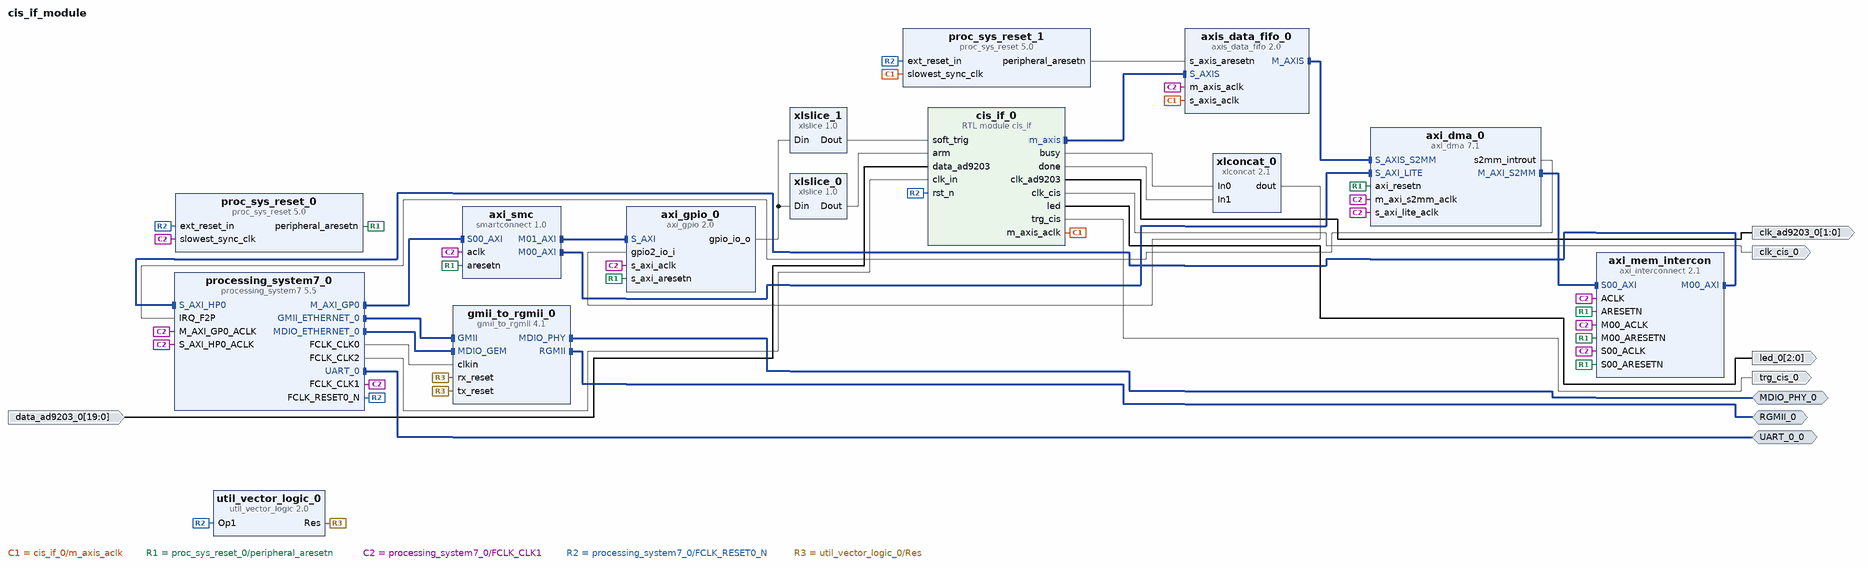
[diagram p0: block diagram of the top level]
# Vivado block design cis_if_module, xc7z020clg484-2, Vivado 2026.1
create_bd_design cis_if_module

create_bd_intf_port -mode Master -vlnv xilinx.com:interface:mdio_rtl:1.0 MDIO_PHY_0
create_bd_intf_port -mode Master -vlnv xilinx.com:interface:rgmii_rtl:1.0 RGMII_0
create_bd_intf_port -mode Master -vlnv xilinx.com:interface:uart_rtl:1.0 UART_0_0
create_bd_port -dir O clk_cis_0
create_bd_port -dir O -from 1 -to 0 clk_ad9203_0
create_bd_port -dir O trg_cis_0
create_bd_port -dir O -from 2 -to 0 led_0
create_bd_port -dir I -from 19 -to 0 data_ad9203_0

create_bd_cell -type ip -vlnv xilinx.com:ip:processing_system7:5.5 processing_system7_0
set_property -dict [list \
  CONFIG.PCW_ENET0_ENET0_IO EMIO \
  CONFIG.PCW_ENET0_GRP_MDIO_ENABLE 1 \
  CONFIG.PCW_ENET0_GRP_MDIO_IO EMIO \
  CONFIG.PCW_ENET0_PERIPHERAL_ENABLE 1 \
  CONFIG.PCW_EN_CLK1_PORT 1 \
  CONFIG.PCW_EN_CLK2_PORT 1 \
  CONFIG.PCW_FCLK_CLK1_BUF TRUE \
  CONFIG.PCW_FCLK_CLK2_BUF TRUE \
  CONFIG.PCW_FPGA0_PERIPHERAL_FREQMHZ 200 \
  CONFIG.PCW_FPGA1_PERIPHERAL_FREQMHZ 100 \
  CONFIG.PCW_FPGA_FCLK1_ENABLE 1 \
  CONFIG.PCW_FPGA_FCLK2_ENABLE 1 \
  CONFIG.PCW_IRQ_F2P_INTR 1 \
  CONFIG.PCW_QSPI_GRP_SINGLE_SS_ENABLE 1 \
  CONFIG.PCW_QSPI_GRP_SINGLE_SS_IO {MIO 1 .. 6} \
  CONFIG.PCW_QSPI_PERIPHERAL_ENABLE 1 \
  CONFIG.PCW_QSPI_QSPI_IO {MIO 1 .. 6} \
  CONFIG.PCW_SINGLE_QSPI_DATA_MODE x4 \
  CONFIG.PCW_UART0_PERIPHERAL_ENABLE 1 \
  CONFIG.PCW_UART0_UART0_IO EMIO \
  CONFIG.PCW_UART_PERIPHERAL_FREQMHZ 100 \
  CONFIG.PCW_UIPARAM_DDR_BUS_WIDTH {16 Bit} \
  CONFIG.PCW_UIPARAM_DDR_PARTNO {MT41J256M16 RE-125} \
  CONFIG.PCW_USE_FABRIC_INTERRUPT 1 \
  CONFIG.PCW_USE_S_AXI_HP0 1 \
] [get_bd_cells processing_system7_0]
# 58 more settings of processing_system7_0 are not shown: defaults, MIO pin electricals, DDR timing, and values the tool derives
create_bd_cell -type module -reference cis_if cis_if_0
create_bd_cell -type ip -vlnv xilinx.com:ip:axis_data_fifo:2.0 axis_data_fifo_0
set_property -dict [list \
  CONFIG.FIFO_DEPTH 1024 \
  CONFIG.HAS_TLAST 1 \
  CONFIG.IS_ACLK_ASYNC 1 \
  CONFIG.TDATA_NUM_BYTES 4 \
] [get_bd_cells axis_data_fifo_0]
create_bd_cell -type ip -vlnv xilinx.com:ip:axi_dma:7.1 axi_dma_0
set_property -dict [list \
  CONFIG.c_include_mm2s 0 \
  CONFIG.c_include_sg 0 \
  CONFIG.c_m_axi_s2mm_data_width 64 \
  CONFIG.c_s_axis_s2mm_tdata_width 32 \
  CONFIG.c_sg_length_width 23 \
] [get_bd_cells axi_dma_0]
create_bd_cell -type ip -vlnv xilinx.com:ip:axi_gpio:2.0 axi_gpio_0
set_property -dict [list \
  CONFIG.C_ALL_INPUTS_2 1 \
  CONFIG.C_ALL_OUTPUTS 1 \
  CONFIG.C_GPIO2_WIDTH 2 \
  CONFIG.C_GPIO_WIDTH 2 \
  CONFIG.C_IS_DUAL 1 \
] [get_bd_cells axi_gpio_0]
create_bd_cell -type ip -vlnv xilinx.com:ip:xlslice:1.0 xlslice_0
set_property -dict {CONFIG.DIN_WIDTH 2 CONFIG.DOUT_WIDTH 1} [get_bd_cells xlslice_0]
create_bd_cell -type ip -vlnv xilinx.com:ip:xlconcat:2.1 xlconcat_0
create_bd_cell -type ip -vlnv xilinx.com:ip:xlslice:1.0 xlslice_1
set_property -dict {CONFIG.DIN_TO 1 CONFIG.DIN_WIDTH 2 CONFIG.DOUT_WIDTH 1} [get_bd_cells xlslice_1]
create_bd_cell -type ip -vlnv xilinx.com:ip:gmii_to_rgmii:4.1 gmii_to_rgmii_0
set_property -dict {CONFIG.SupportLevel Include_Shared_Logic_in_Core} [get_bd_cells gmii_to_rgmii_0]
create_bd_cell -type ip -vlnv xilinx.com:ip:util_vector_logic:2.0 util_vector_logic_0
set_property -dict {CONFIG.C_OPERATION not CONFIG.C_SIZE 1} [get_bd_cells util_vector_logic_0]
create_bd_cell -type ip -vlnv xilinx.com:ip:proc_sys_reset:5.0 proc_sys_reset_0
create_bd_cell -type ip -vlnv xilinx.com:ip:proc_sys_reset:5.0 proc_sys_reset_1
create_bd_cell -type ip -vlnv xilinx.com:ip:smartconnect:1.0 axi_smc
set_property -dict {CONFIG.NUM_MI 2 CONFIG.NUM_SI 1} [get_bd_cells axi_smc]
create_bd_cell -type ip -vlnv xilinx.com:ip:axi_interconnect:2.1 axi_mem_intercon
set_property -dict {CONFIG.NUM_MI 1} [get_bd_cells axi_mem_intercon]

# ---- connections ----

connect_bd_intf_net [get_bd_intf_pins axi_dma_0/M_AXI_S2MM] [get_bd_intf_pins axi_mem_intercon/S00_AXI]
connect_bd_intf_net [get_bd_intf_pins axi_mem_intercon/M00_AXI] [get_bd_intf_pins processing_system7_0/S_AXI_HP0]
connect_bd_intf_net [get_bd_intf_pins axi_smc/M00_AXI] [get_bd_intf_pins axi_dma_0/S_AXI_LITE]
connect_bd_intf_net [get_bd_intf_pins axi_smc/M01_AXI] [get_bd_intf_pins axi_gpio_0/S_AXI]
connect_bd_intf_net [get_bd_intf_pins axis_data_fifo_0/M_AXIS] [get_bd_intf_pins axi_dma_0/S_AXIS_S2MM]
connect_bd_intf_net [get_bd_intf_pins axis_data_fifo_0/S_AXIS] [get_bd_intf_pins cis_if_0/m_axis]
connect_bd_intf_net [get_bd_intf_ports MDIO_PHY_0] [get_bd_intf_pins gmii_to_rgmii_0/MDIO_PHY]
connect_bd_intf_net [get_bd_intf_ports RGMII_0] [get_bd_intf_pins gmii_to_rgmii_0/RGMII]
connect_bd_intf_net [get_bd_intf_pins processing_system7_0/GMII_ETHERNET_0] [get_bd_intf_pins gmii_to_rgmii_0/GMII]
connect_bd_intf_net [get_bd_intf_pins processing_system7_0/MDIO_ETHERNET_0] [get_bd_intf_pins gmii_to_rgmii_0/MDIO_GEM]
connect_bd_intf_net [get_bd_intf_pins processing_system7_0/M_AXI_GP0] [get_bd_intf_pins axi_smc/S00_AXI]
connect_bd_intf_net [get_bd_intf_ports UART_0_0] [get_bd_intf_pins processing_system7_0/UART_0]
connect_bd_net [get_bd_pins axi_dma_0/s2mm_introut] [get_bd_pins processing_system7_0/IRQ_F2P]
connect_bd_net [get_bd_pins axi_gpio_0/gpio_io_o] [get_bd_pins xlslice_0/Din] [get_bd_pins xlslice_1/Din]
connect_bd_net [get_bd_pins cis_if_0/busy] [get_bd_pins xlconcat_0/In0]
connect_bd_net [get_bd_pins cis_if_0/clk_ad9203] [get_bd_ports clk_ad9203_0]
connect_bd_net [get_bd_pins cis_if_0/clk_cis] [get_bd_ports clk_cis_0]
connect_bd_net [get_bd_pins cis_if_0/done] [get_bd_pins xlconcat_0/In1]
connect_bd_net [get_bd_pins cis_if_0/led] [get_bd_ports led_0]
connect_bd_net [get_bd_pins cis_if_0/m_axis_aclk] [get_bd_pins axis_data_fifo_0/s_axis_aclk] [get_bd_pins proc_sys_reset_1/slowest_sync_clk]
connect_bd_net [get_bd_pins cis_if_0/trg_cis] [get_bd_ports trg_cis_0]
connect_bd_net -net data_ad9203_0_1 [get_bd_ports data_ad9203_0] [get_bd_pins cis_if_0/data_ad9203]
connect_bd_net [get_bd_pins proc_sys_reset_0/peripheral_aresetn] \
  [get_bd_pins axi_dma_0/axi_resetn] [get_bd_pins axi_smc/aresetn] [get_bd_pins axi_gpio_0/s_axi_aresetn] \
  [get_bd_pins axi_mem_intercon/S00_ARESETN] [get_bd_pins axi_mem_intercon/M00_ARESETN] \
  [get_bd_pins axi_mem_intercon/ARESETN]
connect_bd_net [get_bd_pins proc_sys_reset_1/peripheral_aresetn] [get_bd_pins axis_data_fifo_0/s_axis_aresetn]
connect_bd_net [get_bd_pins processing_system7_0/FCLK_CLK0] [get_bd_pins gmii_to_rgmii_0/clkin]
connect_bd_net [get_bd_pins processing_system7_0/FCLK_CLK1] \
  [get_bd_pins axi_gpio_0/s_axi_aclk] [get_bd_pins axi_dma_0/s_axi_lite_aclk] [get_bd_pins axi_dma_0/m_axi_s2mm_aclk] \
  [get_bd_pins processing_system7_0/M_AXI_GP0_ACLK] [get_bd_pins processing_system7_0/S_AXI_HP0_ACLK] \
  [get_bd_pins proc_sys_reset_0/slowest_sync_clk] [get_bd_pins axi_smc/aclk] [get_bd_pins axi_mem_intercon/ACLK] \
  [get_bd_pins axi_mem_intercon/S00_ACLK] [get_bd_pins axi_mem_intercon/M00_ACLK] [get_bd_pins axis_data_fifo_0/m_axis_aclk]
connect_bd_net [get_bd_pins processing_system7_0/FCLK_CLK2] [get_bd_pins cis_if_0/clk_in]
connect_bd_net [get_bd_pins processing_system7_0/FCLK_RESET0_N] \
  [get_bd_pins util_vector_logic_0/Op1] [get_bd_pins proc_sys_reset_0/ext_reset_in] \
  [get_bd_pins proc_sys_reset_1/ext_reset_in] [get_bd_pins cis_if_0/rst_n]
connect_bd_net [get_bd_pins util_vector_logic_0/Res] [get_bd_pins gmii_to_rgmii_0/tx_reset] [get_bd_pins gmii_to_rgmii_0/rx_reset]
connect_bd_net [get_bd_pins xlconcat_0/dout] [get_bd_pins axi_gpio_0/gpio2_io_i]
connect_bd_net [get_bd_pins xlslice_0/Dout] [get_bd_pins cis_if_0/arm]
connect_bd_net [get_bd_pins xlslice_1/Dout] [get_bd_pins cis_if_0/soft_trig]

# ---- address map ----
assign_bd_address -offset 0x00000000 -range 512M -target_address_space [get_bd_addr_spaces axi_dma_0/Data_S2MM] [get_bd_addr_segs processing_system7_0/S_AXI_HP0/HP0_DDR_LOWOCM]
assign_bd_address -offset 0x40400000 -range 64K -target_address_space [get_bd_addr_spaces processing_system7_0/Data] [get_bd_addr_segs axi_dma_0/S_AXI_LITE/Reg]
assign_bd_address -offset 0x41200000 -range 64K -target_address_space [get_bd_addr_spaces processing_system7_0/Data] [get_bd_addr_segs axi_gpio_0/S_AXI/Reg]

validate_bd_design
save_bd_design
